# Altium project IndexMicrocontroller.PrjPcb
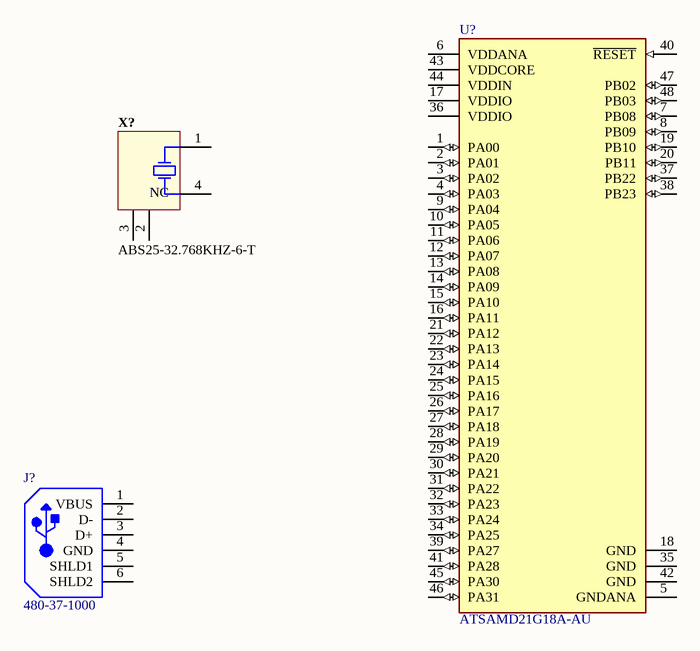
[diagram p0: Sheet1.SchDoc]
1 sheet, 3 parts. Net scope: global (net labels, ports and power ports of the same name join across sheets).

## Sheet Sheet1.SchDoc
size A; SheetNumber: 1; SheetTotal: 1

### Parts
J?  480-37-1000  [MOLX-480-37-1000_V]
U?  ATSAMD21G18A-AU  [FP-MC-IPC_C]
X?  ABS25-32.768KHZ-6-T  [ABRA-ABS25-4_V]

### Nets

Not connected (* = marked no-connect by the designer): J? 1(VBUS) 2(D-) 3(D+) 4(GND) 5(SHLD1) 6(SHLD2); U? 1(PA00) 2(PA01) 3(PA02) 4(PA03) 5(GNDANA) 6(VDDANA) 7(PB08) 8(PB09) 9(PA04) 10(PA05) 11(PA06) 12(PA07) 13(PA08) 14(PA09) 15(PA10) 16(PA11) 17(VDDIO) 18(GND) 19(PB10) 20(PB11) 21(PA12) 22(PA13) 23(PA14) 24(PA15) 25(PA16) 26(PA17) 27(PA18) 28(PA19) 29(PA20) 30(PA21) 31(PA22) 32(PA23) 33(PA24) 34(PA25) 35(GND) 36(VDDIO) 37(PB22) 38(PB23) 39(PA27) 40(~{RESET}) 41(PA28) 42(GND) 43(VDDCORE) 44(VDDIN) 45(PA30) 46(PA31) 47(PB02) 48(PB03); X? 1(X1) 2(NC) 3(NC) 4(X2)

### Library data of the parts
J? = CMP-1676-00005-1: Universal Serial Bus (USB) Shielded I/O Plug, Type A, Right Angle Connector, 1.5 A, -20 to 85 degC, 4-Pin SMD, RoHS, Tray; Tolerance: 1%; Power Rating: 100 mW; Voltage Rating: 50 V; Case\Package: 0603; Resistance: 1 mohm; Width: 0.8 mm; Mount: Surface Mount; ComponentLink1URL: http://www.molex.com/; ComponentLink1Description: Manufacturer URL; REACH SVHC: No SVHC; Case Code (Imperial): 0603; Height: 0.45 mm; Max Operating Temperature: 155 degC; ComponentLink2Description: Datasheet; Min Operating Temperature: -55 degC; Length: 1.6 mm; Pins: 2; RoHSCompliant: true; Package Quantity: 5000; DatasheetVersion: Rev. D, 06/2004; PackageDescription: 4-Pin Surface Mount Device, Body 12 x 18.8 mm; Voltage Rating (DC): 50 V; PackageReference: 480-37-1000; Case Code (Metric): 1608; ComponentLink2URL: http://www.molex.com/pdm_docs/sd/480371000_sd.pdf; Packaging: Tape and Reel
U? = CMP-06276-000071-1: IC MCU 32BIT 256KB FLASH 48TQFP; Core Architecture: ARM; Oscillator Type: Internal; Frequency: 48MHz; Interface: I2C; Peripherals: Brown-out Detect/Reset; Number of I/Os: 38; Max Operating Temperature: 85°C; Memory Size: 256KB; Memory Type: FLASH; Case/Package: TQFP; Packaging: Tray; Min Operating Temperature: -40°C
X? = CMP-2000-05036-1: Low Frequency Crystal, 32.768 KHz, 6 pF, +/- 20 ppm, -40 to 85 degC, 4-Pin SMD, RoHS, Tape and Reel; Manufacturer: Abracon; Tolerance: 20PPM; ESR: 50kOhms; Case Width: 3.8mm; Case Height: 2.5mm; Case Length: 8mm; Load Capacitance: 6pF; Operating Temperature Range: -40Cto+85C; Package Reference: ABS25; Factory Pack Quantity: 3000; Package Description: 4-Pin Surface Mount Device, Body 8 x 3.8 mm, Pitch 5.5 mm; Frequency: 32.768kHz; Termination Style: SMD/SMT; Manufacturer URL: http://www.abracon.com/; Type: LowFrequencyCrystal; Dimensions: 3.8mmWx8mmLx2.5mmH; Product Category: Crystals; Series: ABS25; RoHS: Details; Package / Case: 8mmx3.8mm; Datasheet Version: Jun-17; Brand: ABRACON; Datasheet URL: https://datasheet.ciiva.com/854/abs25-854528.pdf; Packaging: Reel; Mounting Style: SMD/SMT